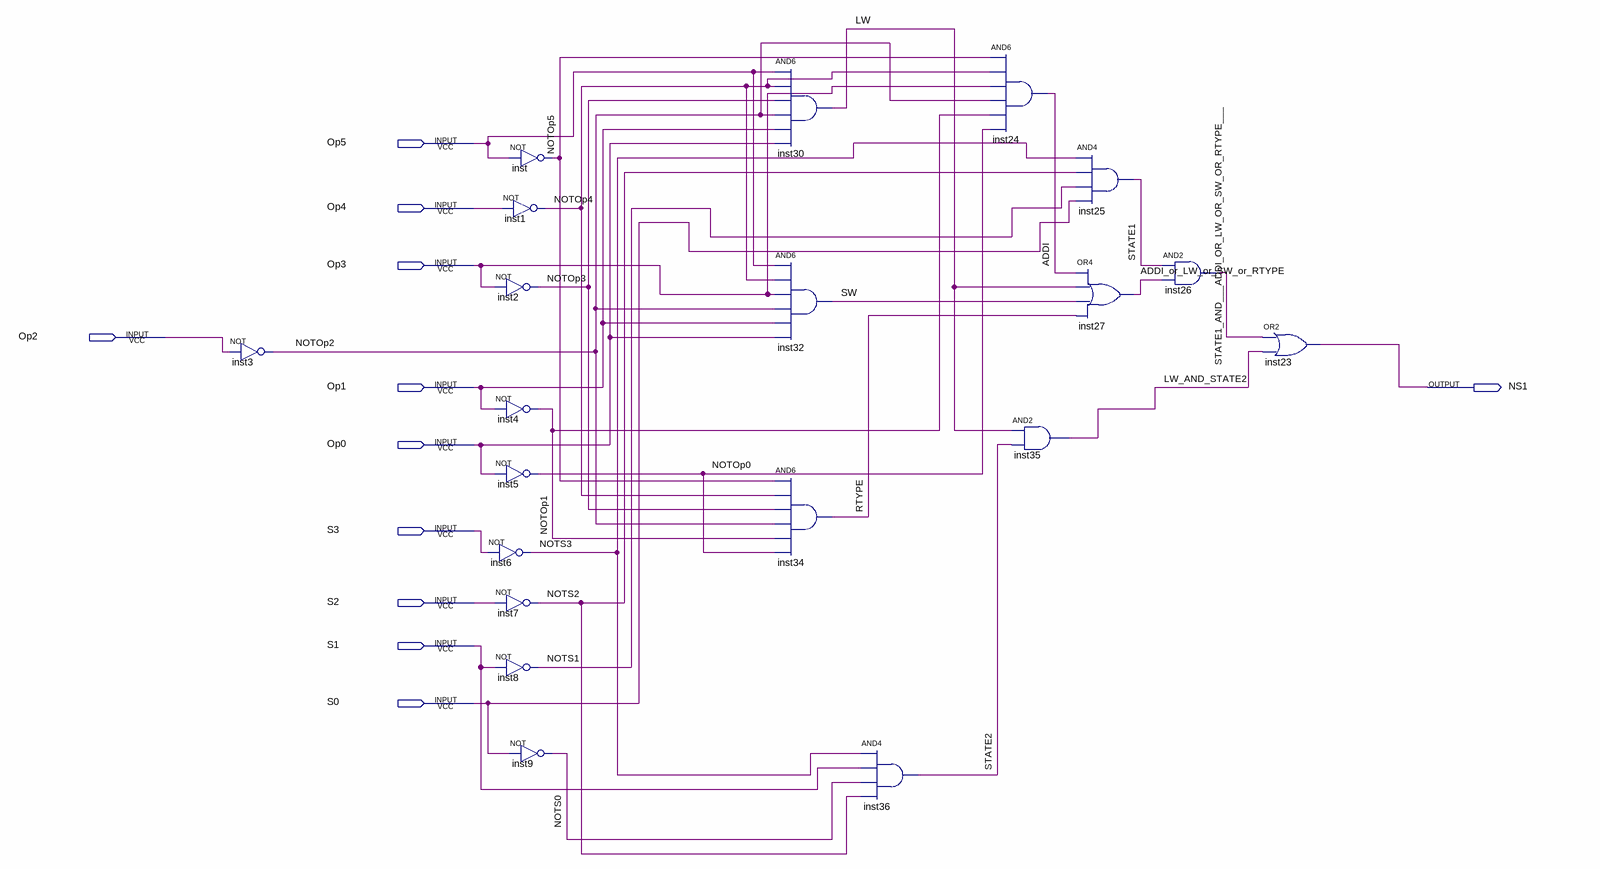
[diagram p0: schematic sheet]
// Quartus schematic NS1.bdf as structural Verilog: 20 symbols, 11 pins
module NS1 (
  input  Op5,
  input  Op4,
  input  Op3,
  input  Op2,
  input  Op1,
  input  Op0,
  input  S3,
  input  S2,
  input  S1,
  input  S0,
  output NS1
);

  wire ADDI, ADDI_or_LW_or_SW_or_RTYPE, LW, LW_AND_STATE2, NOTOp0, NOTOp1, NOTOp2, NOTOp3, NOTOp4, NOTOp5,
       NOTS0, NOTS1, NOTS2, NOTS3, RTYPE, STATE1, STATE1_AND___ADDI_OR_LW_OR_SW_OR_RTYPE___, STATE2, SW;

  not inst3 (NOTOp2, Op2);
  not inst (NOTOp5, Op5);
  not inst1 (NOTOp4, Op4);
  not inst2 (NOTOp3, Op3);
  not inst4 (NOTOp1, Op1);
  not inst5 (NOTOp0, Op0);
  not inst6 (NOTS3, S3);
  not inst7 (NOTS2, S2);
  not inst8 (NOTS1, S1);
  not inst9 (NOTS0, S0);
  and inst30 (LW, Op5, NOTOp4, NOTOp3, NOTOp2, Op1, Op0);
  and inst32 (SW, Op5, NOTOp4, Op3, NOTOp2, Op1, Op0);
  and inst34 (RTYPE, NOTOp5, NOTOp4, NOTOp3, NOTOp2, NOTOp1, NOTOp0);
  and inst36 (STATE2, NOTS3, S1, NOTS0, NOTS2);
  and inst24 (ADDI, NOTOp5, NOTOp4, Op3, NOTOp2, NOTOp1, NOTOp0);
  and inst35 (LW_AND_STATE2, LW, STATE2);
  and inst25 (STATE1, NOTS3, NOTS2, NOTS1, S0);
  or inst27 (ADDI_or_LW_or_SW_or_RTYPE, ADDI, LW, SW, RTYPE);
  and inst26 (STATE1_AND___ADDI_OR_LW_OR_SW_OR_RTYPE___, STATE1, ADDI_or_LW_or_SW_or_RTYPE);
  or inst23 (NS1, STATE1_AND___ADDI_OR_LW_OR_SW_OR_RTYPE___, LW_AND_STATE2);
endmodule
